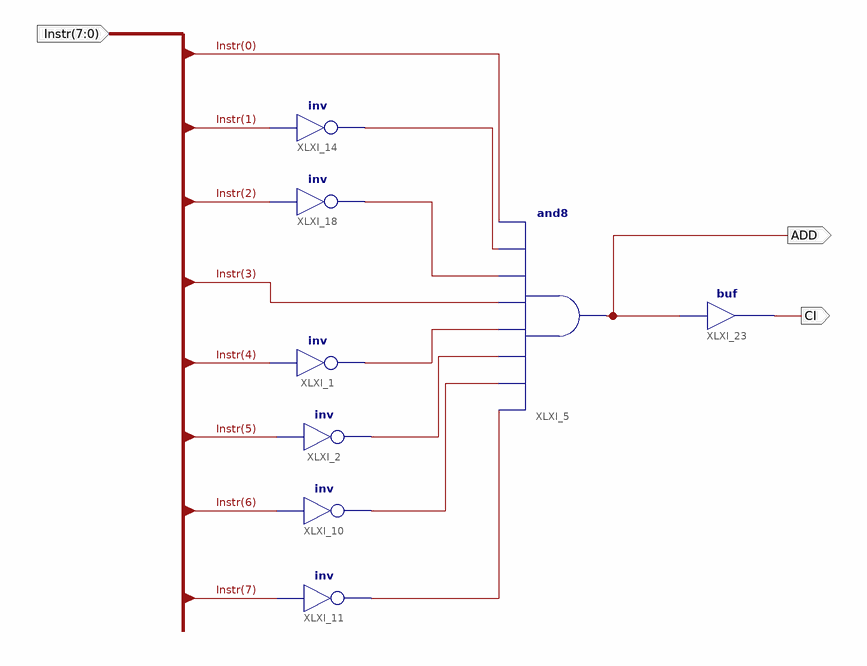
[diagram p0: schematic sheet 1]
// Xilinx ISE schematic isntrSUBU.sch (spartan3e) as structural Verilog: 8 symbols, 3 ports
module isntrSUBU (
  input  [7:0] Instr,
  output ADD,
  output CI
);

  wire XLXN_2, XLXN_3, XLXN_4, XLXN_5, XLXN_6, XLXN_15;

  not XLXI_1 (XLXN_2, Instr[4]);
  not XLXI_2 (XLXN_3, Instr[5]);
  not XLXI_10 (XLXN_4, Instr[6]);
  not XLXI_11 (XLXN_5, Instr[7]);
  and XLXI_5 (ADD, XLXN_5, XLXN_4, XLXN_3, XLXN_2, Instr[3], XLXN_15, XLXN_6, Instr[0]);
  not XLXI_18 (XLXN_15, Instr[2]);
  not XLXI_14 (XLXN_6, Instr[1]);
  buf XLXI_23 (CI, ADD);
endmodule
